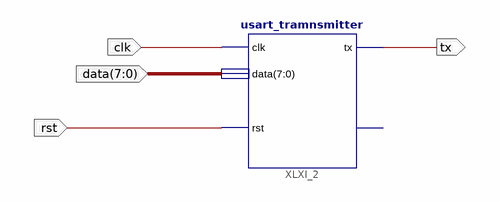
[diagram p0: schematic sheet 1]
// Xilinx ISE schematic USART.sch (aspartan6) as structural Verilog: 1 symbols, 4 ports
module USART (
  input  [7:0] data,
  input  clk,
  input  rst,
  output tx
);

  usart_tramnsmitter XLXI_2 (.clk(clk), .rst(rst), .data(data), .tx(tx));  // open: done
endmodule
